# Altium schematic sheet OurEDA-P1K_sd.SchDoc
size A4; SheetNumber: 7; SheetTotal: 7
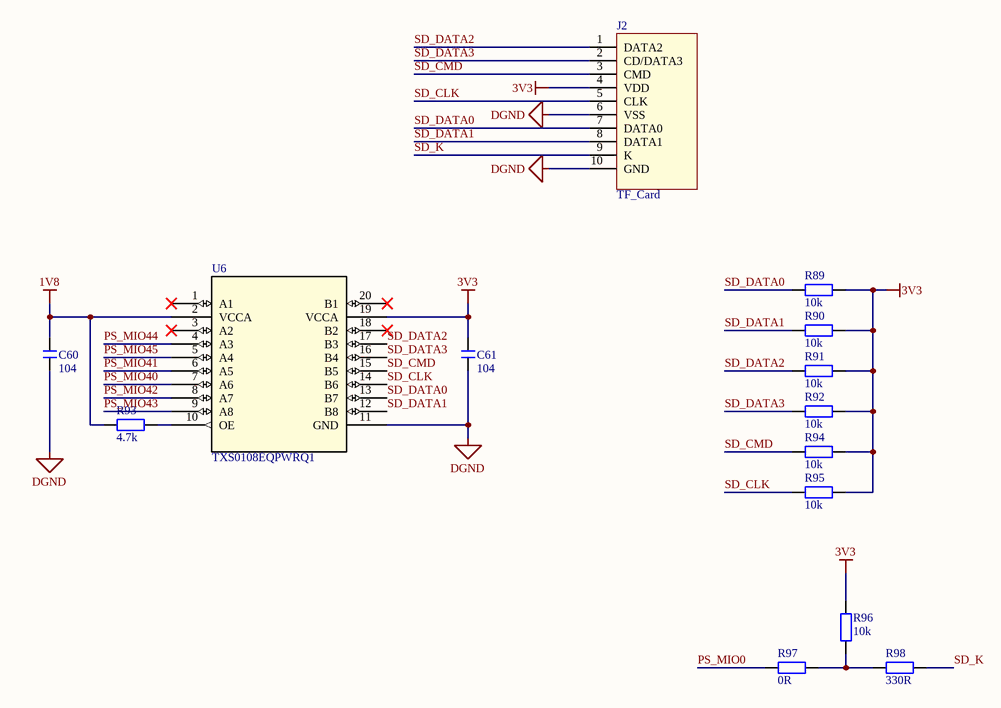
[diagram p0: OurEDA-P1K_sd.SchDoc]

## Parts
C60  104  [C 0603_L]
C61  104  [C 0603_L]
J2  TF_Card  [Micro SD]
R89  10k  [R 0603_L]
R90  10k  [R 0603_L]
R91  10k  [R 0603_L]
R92  10k  [R 0603_L]
R93  4.7k  [R 0603_L]
R94  10k  [R 0603_L]
R95  10k  [R 0603_L]
R96  10k  [R 0603_L]
R97  0R  [R 0603_L]
R98  330R  [R 0603_L]
U6  TXS0108EQPWRQ1  [PW20_TEX]

## Nets
1V8: C60.1 R93.2 U6.2(VCCA)
3V3: C61.1 J2.4(VDD) R89.1 R90.1 R91.1 R92.1 R94.1 R95.1 R96.2 U6.19(VCCA)
DGND: C60.2 C61.2 J2.6(VSS) J2.10(GND) U6.11(GND)
PS_MIO0: R97.2
PS_MIO40: U6.7(A6)
PS_MIO41: U6.6(A5)
PS_MIO42: U6.8(A7)
PS_MIO43: U6.9(A8)
PS_MIO44: U6.4(A3)
PS_MIO45: U6.5(A4)
SD_CLK: J2.5(CLK) R95.2 U6.14(B6)
SD_CMD: J2.3(CMD) R94.2 U6.15(B5)
SD_DATA0: J2.7(DATA0) R89.2 U6.13(B7)
SD_DATA1: J2.8(DATA1) R90.2 U6.12(B8)
SD_DATA2: J2.1(DATA2) R91.2 U6.17(B3)
SD_DATA3: J2.2(CD/DATA3) R92.2 U6.16(B4)
SD_K: J2.9(K) R98.1
NetR93_1: R93.1 U6.10(OE)
NetR96_1: R96.1 R97.1 R98.2

Not connected (* = marked no-connect by the designer): U6 1(A1)* 3(A2)* 18(B2)* 20(B1)*

## Library data of the parts
C60 C61 = C: 无极性贴片电容; 版权归属: 源创客; BOM名称: 无极性贴片电容; 学习资源: www.ooocke.com
J2 = TF_Card: TF卡座; 版权归属: 源创客; BOM名称: TF卡座; 学习资源: www.ooocke.com
R89-R98 = R: 贴片电阻; 版权归属: 源创客; BOM名称: 贴片电阻; 学习资源: www.ooocke.com
U6 = TXS0108EQPWRQ1: No Description Available; Mfr_Name: Texas Instruments; Copyright: Copyright (C) 2022 Ultra Librarian. All rights reserved.; Manufacturer_Part_Number: TXS0108EQPWRQ1; RefDes: RefDes; Type: DEV